# EAGLE design UsbC (EAGLE 9.6.2)
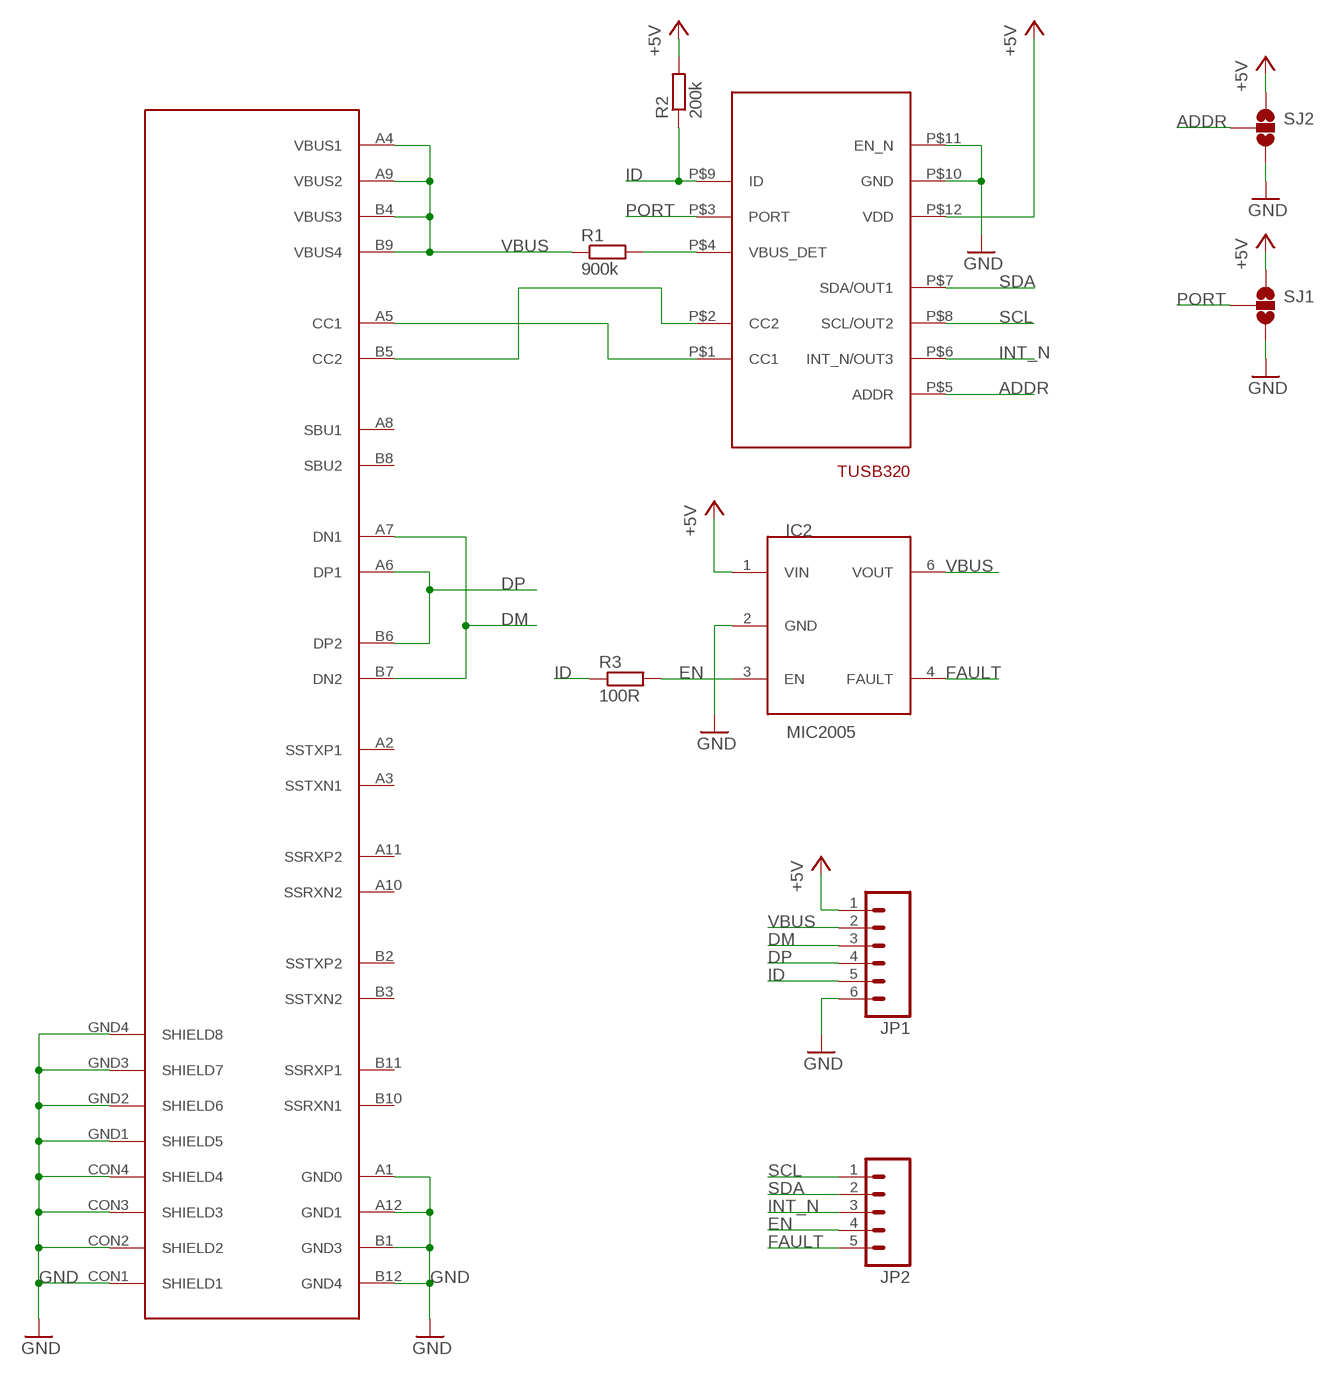
[diagram p0: schematic, sheet 1]

## Parts
CONN1  USB-C_WURTH_632723X00011USB-C  [USB-C_WURTH_632723X00011]
IC1  TUSB320XQFN  [X2QFN]
IC2  MIC2005  [SOT23-6]
JP1  M06SIP  [1X06]
JP2  M05PTH  [1X05]
R1  900k  R-EU_0603  [0603]
R2  200k  R-EU_0603  [0603]
R3  100R  R-EU_0603  [0603]
SJ1  SOLDERJUMPER_2WAYS  [SJ_3]
SJ2  SOLDERJUMPER_2WAYS  [SJ_3]

## Nets
+5V: IC1.P$12(VDD) IC2.1(VIN) JP1.1 R2.2 SJ1.1 SJ2.1
ADDR: IC1.P$5(ADDR) SJ2.2
CC1: CONN1.A5(CC1) IC1.P$1(CC1)
CC2: CONN1.B5(CC2) IC1.P$2(CC2)
DM: CONN1.A7(DN1) CONN1.B7(DN2) JP1.3
DP: CONN1.A6(DP1) CONN1.B6(DP2) JP1.4
EN: IC2.3(EN) JP2.4 R3.2
FAULT: IC2.4(FAULT) JP2.5
GND: CONN1.A1(GND0) CONN1.A12(GND1) CONN1.B1(GND3) CONN1.B12(GND4) CONN1.CON1(SHIELD1) CONN1.CON2(SHIELD2) CONN1.CON3(SHIELD3) CONN1.CON4(SHIELD4) CONN1.GND1(SHIELD5) CONN1.GND2(SHIELD6) CONN1.GND3(SHIELD7) CONN1.GND4(SHIELD8) IC1.P$10(GND) IC1.P$11(EN_N) IC2.2(GND) JP1.6 SJ1.3 SJ2.3
ID: IC1.P$9(ID) JP1.5 R2.1 R3.1
INT_N: IC1.P$6(INT_N/OUT3) JP2.3
N$9: IC1.P$4(VBUS_DET) R1.2
PORT: IC1.P$3(PORT) SJ1.2
SCL: IC1.P$8(SCL/OUT2) JP2.1
SDA: IC1.P$7(SDA/OUT1) JP2.2
VBUS: CONN1.A4(VBUS1) CONN1.A9(VBUS2) CONN1.B4(VBUS3) CONN1.B9(VBUS4) IC2.6(VOUT) JP1.2 R1.1
Unconnected: CONN1.A2(SSTXP1) CONN1.A3(SSTXN1) CONN1.A8(SBU1) CONN1.A10(SSRXN2) CONN1.A11(SSRXP2) CONN1.B2(SSTXP2) CONN1.B3(SSTXN2) CONN1.B8(SBU2) CONN1.B10(SSRXN1) CONN1.B11(SSRXP1)

## Library data of the parts
CONN1 = USB-C:USB-C_WURTH_632723X00011: Wurth USB C connector
IC1 = USB-C:TUSB320: TUSB320 USB Type-C Configuration Channel Logic and Port Control
IC2 = Rebel:MIC2005
JP1 = SparkFun:M06: Header 6 Standard 6-pin 0.1" header. Use with straight break away headers (SKU : PRT-00116), right angle break away headers (PRT-00553), swiss pins (PRT-00743), machine pins (PRT-00117), and female headers (PRT-00115). Molex polarized connector foot print use with SKU : PRT-08094 with associated crimp pins and housings. NOTES ON THE VARIANTS LOCK and LOCK_LONGPADS... This footprint was designed to help hold the alignment of a through-hole component (i.e. 6-pin header) while soldering it into place. You may notice that each hole has been shifted either up or down by 0.005 of an inch from it's more standard position (which is a perfectly straight line). This slight alteration caused the pins (the squares in the middle) to touch the edges of the holes. Because they are alternating, it causes a "brace" to hold the component in place. 0.005 has proven to be the perfect amount of "off-center" position when using our standard breakaway headers. Although looks a little odd when you look at the bare footprint, once you have a header in there, the alteration is very hard to notice. Also, if you push a header all the way into place, it is covered up entirely on the bottom side. This idea of altering the position of holes to aid alignment will be further integrated into the Sparkfun Library for other footprints. It can help hold any component with 3 or more connection pins.
JP2 = SparkFun:M05: Header 5 Standard 5-pin 0.1" header. Use with straight break away headers (SKU : PRT-00116), right angle break away headers (PRT-00553), swiss pins (PRT-00743), machine pins (PRT-00117), and female headers (PRT-00115). Molex polarized connector foot print use with SKU : PRT-08230 with associated crimp pins and housings.
R1-R3 = Rebel:R-EU_: RESISTOR, European symbol
SJ1 SJ2 = SparkFun:SOLDERJUMPER_2WAY: Solder Jumper 2 way solder jumper

## Board
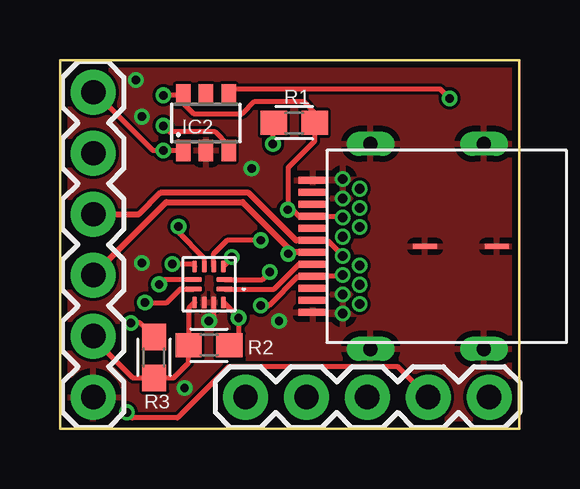
[diagram p1: board, top side]
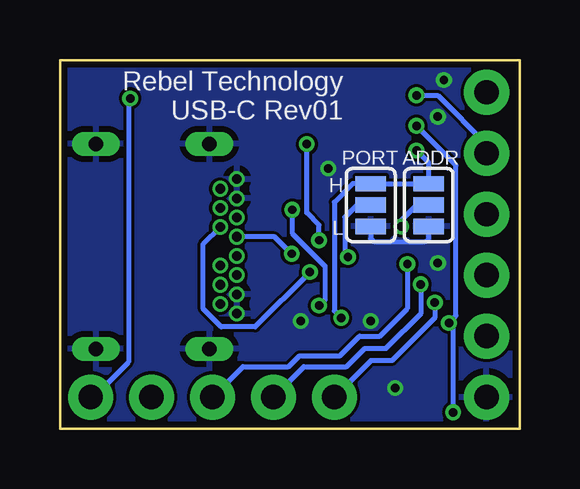
[diagram p2: board, bottom side, seen from below]

Size 19.16 x 15.36 mm. Coordinates in mm from the lower left corner, seen from the top.
Outline: 0,0 19.16,0 19.16,15.36 0,15.36 0,0
Copper layers (1*16): Top 0.035mm / dielectric 1.5mm / Bottom 0.035mm
Design rules "dirt_cheap_dirty_boards.v1 *": minimum track width 5mil, minimum drill 12mil, track to track 5mil, track to pad 5mil, pad to pad 5mil, via to via 5mil, smd to smd 0mil, copper to edge 10mil, drill to drill 10mil, minimum pad ring 4mil, minimum via ring 6mil, stop-mask expansion 2mil, vias tented up to drill 25mil, thermal gap 10mil

### Footprints (pad centres in the part's own frame; a part is rotated, then mirrored left to right if it is on the bottom)
USB-C_WURTH_632723X00011 = smd 0.3 x 1.2: A1 -2.75,10.58; A2 -2.25,10.58; A3 -1.75,10.58; A4 -1.25,10.58; A5 -0.75,10.58; A6 -0.25,10.58; A7 0.25,10.58; A8 0.75,10.58; A9 1.25,10.58; A10 1.75,10.58; A11 2.25,10.58; A12 2.75,10.58 | drill 0.4 pad 0.65: B1 2.8,9.33; B2 2.4,8.63; B3 1.6,8.63; B4 1.2,9.33; B5 0.8,8.63; B6 0.4,9.33; B7 -0.4,9.33; B8 -0.8,8.63; B9 -1.2,9.33; B10 -1.6,8.63; B11 -2.4,8.63; B12 -2.8,9.33; GND1 2,9.33; GND2 -2,9.33 | drill 0.6 pad 1 long: CON1 4.27,8.18; CON2 4.27,3.45; CON3 -4.27,3.45; CON4 -4.27,8.18 | smd 0.2 x 1: GND3 0,2.9; GND4 0,5.9
X2QFN = smd 0.7 x 0.2: P$1 -0.65,0.2; P$2 -0.65,-0.2; P$7 0.65,-0.2; P$8 0.65,0.2 | smd 0.2 x 0.5: P$3 -0.6,-0.75; P$4 -0.2,-0.75; P$5 0.2,-0.75; P$6 0.6,-0.75; P$9 0.6,0.75; P$10 0.2,0.75; P$11 -0.2,0.75; P$12 -0.6,0.75
SOT23-6 = smd 0.6 x 0.9: 1 -0.95,-1.15; 2 0,-1.15; 3 0.95,-1.15; 4 0.95,1.15; 5 0,1.15; 6 -0.95,1.15
1X06 = drill 1.016 pad 1.88: 1 0,0; 2 2.54,0; 3 5.08,0; 4 7.62,0; 5 10.16,0; 6 12.7,0
1X05 = drill 1.016 pad 1.88: 1 0,0; 2 2.54,0; 3 5.08,0; 4 7.62,0; 5 10.16,0
0603 = smd 1.1 x 1: 1 -0.85,0; 2 0.85,0
SJ_3 = smd 0.635 x 1.27: 1 -0.889,0; 2 0,0; 3 0.889,0

### Placement (x,y rotation side)
CONN1  21.13,7.59 90 top
IC1  6.21,6.01 180 top
IC2  6.09,12.74 0 top
JP1  1.39,14.01 270 top
JP2  7.74,1.31 0 top
R1  9.77,12.74 180 top
R2  6.21,3.47 0 top
R3  3.93,2.96 90 top
SJ1  6.21,9.31 270 bottom
SJ2  3.8,9.31 270 bottom

### Tracks (layer width: path | path; a pad name or v marks a point on that pad's centre or on a via)
+5V  (via drill 0.35)
  Top 0.203: IC1.P$12 7.45,4.63 v7.45,4.61 7.45,3.85 R2.2 | JP1.1 1.45,14.01 3.87,11.59 v4.31,11.59 IC2.1
  Bottom 0.203: v4.31,11.59 3.8,11.08 SJ2.1 SJ1.1 6.98,10.2 7.74,9.44 7.74,4.91 v7.45,4.61
ADDR  (via drill 0.35)
  Top 0.203: v4.95,8.42 4.95,8.17 6.02,7.1 IC1.P$5
  Bottom 0.203: v4.95,8.42 4.95,8.68 4.31,9.31 SJ2.2
CC1
  Top 0.203: IC1.P$1 8.94,5.81 9.97,6.84 CONN1.A5
CC2  (via drill 0.35)
  Top 0.203: IC1.P$2 8.45,6.21 v8.75,6.52
  Bottom 0.203: CONN1.B5 13.2,7.69 13.2,4.98 12.45,4.24 11.04,4.24 v8.75,6.52
DM
  Top 0.203: CONN1.A7 11.15,7.84 CONN1.B7
  Top 0.254: CONN1.A7 9.84,7.84 7.87,9.82 4.18,9.82 3.29,8.93 JP1.3
DP  (via drill 0.35)
  Top 0.203: 9.57,7.34 v9.52,7.29
  Top 0.254: CONN1.A6 9.57,7.34 | JP1.4 4.44,9.44 7.62,9.44 9.52,7.54 v9.52,7.29
  Bottom 0.203: v9.52,7.29 10.22,7.99 CONN1.B6
EN  (via drill 0.35)
  Top 0.203: R3.2 3.34,4.4 v2.96,4.4 | v4.31,12.62 4.56,12.36 6.47,12.36 7.04,11.79 IC2.3 | JP2.4 14.09,2.58 7.04,2.58 4.91,0.45 3.02,0.45 v2.79,0.68
  Bottom 0.203: v4.31,12.62 2.66,10.96 2.66,4.7 v2.96,4.4 2.79,4.23 v2.79,0.68
FAULT  (via drill 0.35)
  Top 0.203: IC2.4 7.29,14.15 15.86,14.15 v16.25,13.76
  Bottom 0.203: JP2.5 17.78,1.31 16.32,2.77 16.32,13.68 v16.25,13.76
GND  (via drill 0.35)
  Top 0.203: v6.21,4.49 6.41,4.69 IC1.P$11
  Bottom 0.203: SJ1.3 6.21,7.92 6.09,7.79 3.93,7.79 3.8,7.92 SJ2.3
  other vias: 3.42,6.9 9.14,4.49 7.99,10.84 3.17,14.52 3.42,13 5.2,1.69
  pour Top: -0.13,-0.76 19.91,-0.76 19.91,15.61 -0.13,15.61
  pour Bottom: -0.63,-0.76 19.66,-0.76 19.66,15.61 -0.63,15.61
ID
  Top 0.203: IC1.P$9 5.37,5.01 R2.1 5.37,2.75 4.73,2.11 R3.1 3.04,2.11 1.39,3.76 JP1.5
INT_N  (via drill 0.35)
  Top 0.203: IC1.P$6 5.52,6.86 v4.69,6.86
  Bottom 0.203: v4.69,6.86 4.69,5 5.83,3.85 6.68,3.85 7.51,3.03 9.2,3.03 9.64,2.58 11.55,2.58 JP2.3
N$9  (via drill 0.35)
  Top 0.203: v8.37,7.85 6.98,7.85 6.41,7.28 IC1.P$4 | v8.88,11.85 8.88,12.7 R1.2
  Bottom 0.203: v8.37,7.85 8.37,8.48 8.88,8.99 v8.88,11.85
PORT  (via drill 0.35)
  Top 0.203: v7.17,7.15 7.17,7.12 IC1.P$3
  Bottom 0.203: SJ1.2 6.79,9.31 7.3,8.8 7.3,7.28 v7.17,7.15
SCL  (via drill 0.35)
  Top 0.203: v3.55,5.25 4.45,5.25 5.01,5.81 IC1.P$8
  Bottom 0.203: v3.55,5.25 3.55,4.61 5.33,2.84 6.21,2.84 JP2.1
SDA  (via drill 0.35)
  Top 0.203: IC1.P$7 4.34,6.21 v4.13,6.01
  Bottom 0.203: v4.13,6.01 4.13,4.79 5.58,3.34 6.47,3.34 7.23,2.58 9.01,2.58 JP2.2
VBUS  (via drill 0.35)
  Top 0.203: CONN1.B4 11.75,8.84 CONN1.A9 9.98,8.84 9.52,9.3 | v4.31,13.89 v4.32,13.89 IC2.6 5.14,13.57 5.58,13.12 7.61,13.12 8.12,13.63 10.15,13.63 10.62,13.16 R1.1 10.62,11.98 9.52,10.88 9.52,9.3 | CONN1.B9 11.75,6.34 CONN1.A4 9.93,6.34 8.71,5.12 v8.37,5.12 | 9.52,9.3 9.52,9.14 v9.49,9.12
  Bottom 0.203: v4.31,13.89 3.42,13.89 1.39,11.85 JP1.2 | v9.49,9.12 9.49,8.15 8.12,6.77 8.12,5.38 v8.37,5.12

### Text on the board
bPlace: Rebel Technology / USB-C Rev01 | ADDR | PORT | H | L